# EAGLE design RAK4600_iBug (EAGLE 9.5.0)
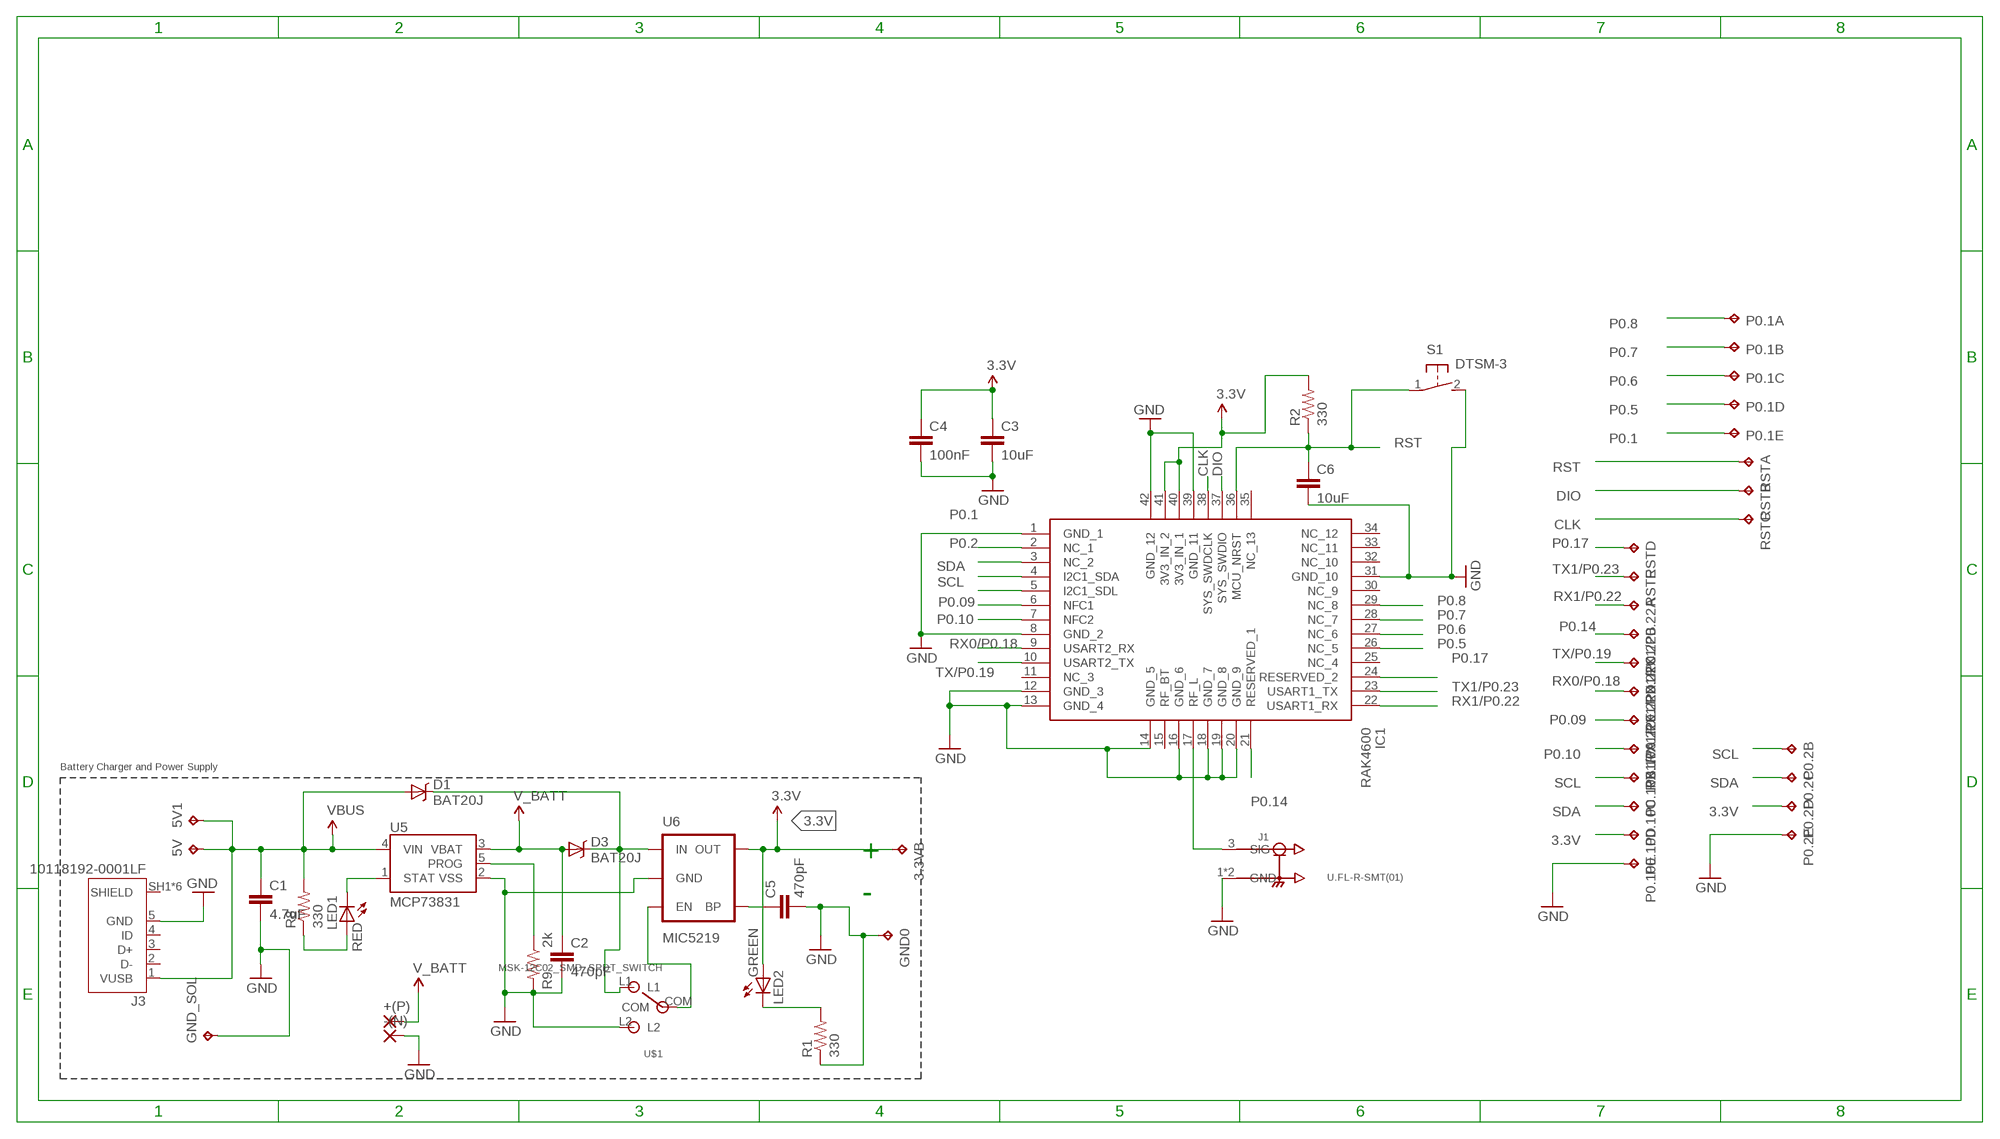
[diagram p0: schematic, sheet 1]

## Parts
3.3VB  TPTP12SQ  [TP12SQ]
5V  TPTP12SQ  [TP12SQ]
5V1  TPTP12SQ  [TP12SQ]
+(P)  SMD2  [SMD1,27-2,54]
-(N)  SMD2  [SMD1,27-2,54]
C1  4.7uF  CAP0402-CAP  [0402-CAP]
C2  470pF  CAP0402-CAP  [0402-CAP]
C3  10uF  CAP0402-CAP  [0402-CAP]
C4  100nF  CAP0402-CAP  [0402-CAP]
C5  470pF  CAP0402-CAP  [0402-CAP]
C6  10uF  CAP0402-CAP  [0402-CAP]
D1  BAT20J  DIODE-SCHOTTKY-BAT20J  [SOD-323]
D3  BAT20J  DIODE-SCHOTTKY-BAT20J  [SOD-323]
GND0  TPTP12SQ  [TP12SQ]
GND_SOL  TPTP12SQ  [TP12SQ]
IC1  RAK4600  [RAK4600]
J1  U.FL-R-SMT(01)  [HRS_U.FL-R-SMT(01)]
J3  10118192-0001LF  [AMPHENOL_10118192-0001LF]
LED1  RED  LED0603  [LED-0603]
LED2  GREEN  LED0603  [LED-0603]
P0.1  TP5P5-25-13  [P5-25-13]
P0.2  TP5P5-25-13  [P5-25-13]
P0.10  TP5P5-25-13  [P5-25-13]
R1  330  RESISTOR0402-RES  [0402-RES]
R2  330  RESISTOR0402-RES  [0402-RES]
R8  330  RESISTOR0402-RES  [0402-RES]
R9  2k  RESISTOR0603-RES  [0603-RES]
RST  TP5P5-25-13  [P5-25-13]
RX1/P0.22  TP5P5-25-13  [P5-25-13]
S1  DTSM-3  [DTSM-3]
U5  MCP73831  [SOT23-5]
U6  MIC5219  V_REG_MIC52193.3V  [SOT23-5]
U$1  MSK-12C02_SMD_SPDT_SWITCH  [MSK-12C02]

## Nets
3.3V: 3.3VB.TP C3.1 C4.1 IC1.40(3V3_IN_1) IC1.41(3V3_IN_2) LED2.A P0.2.TP-4 P0.10.TP-4 R2.2 U6.5(OUT)
5V: 5V1.TP 5V.TP C1.1 D1.A J3.1(VUSB) R8.2 U5.4(VIN) ; supply symbol labelled VBUS
CLK: IC1.38(SYS_SWDCLK) RST.TP-3
DIO: IC1.37(SYS_SWDIO) RST.TP-2
GND: -(N).1(P) C1.2 C2.2 C3.2 C4.2 C5.2 C6.2 GND0.TP GND_SOL.TP IC1.1(GND_1) IC1.8(GND_2) IC1.12(GND_3) IC1.13(GND_4) IC1.14(GND_5) IC1.16(GND_6) IC1.18(GND_7) IC1.19(GND_8) IC1.20(GND_9) IC1.31(GND_10) IC1.39(GND_11) IC1.42(GND_12) J1.1(GND) J1.2(GND) J3.5(GND) P0.2.TP-5 P0.10.TP-5 R1.1 R9.2 S1.2 U5.2(VSS) U6.2(GND) U$1.L2
N$1: LED2.C R1.2
N$2: D1.C D3.C U6.1(IN) U$1.L1
N$3: IC1.17(RF_L) J1.3(SIG)
N$4: R9.1 U5.5(PROG)
N$5: U6.3(EN) U$1.COM
N$12: LED1.A R8.1
N$13: LED1.C U5.1(STAT)
N$15: C5.1 U6.4(BP)
P0.1: IC1.2(NC_1) P0.1.TP-5
P0.2: IC1.3(NC_2)
P0.5: IC1.26(NC_5) P0.1.TP-4
P0.6: IC1.27(NC_6) P0.1.TP-3
P0.7: IC1.28(NC_7) P0.1.TP-2
P0.8: IC1.29(NC_8) P0.1.TP-1
P0.09: IC1.6(NFC1) RX1/P0.22.TP-5
P0.10: IC1.7(NFC2) P0.10.TP-1
P0.14: IC1.21(RESERVED_1) RX1/P0.22.TP-2
P0.17: IC1.24(RESERVED_2) RST.TP-4
RST: C6.1 IC1.36(MCU_NRST) R2.1 RST.TP-1 S1.1
RX0/P0.18: IC1.9(USART2_RX) RX1/P0.22.TP-4
RX1/P0.22: IC1.22(USART1_RX) RX1/P0.22.TP-1
SCL: IC1.5(I2C1_SDL) P0.2.TP-2 P0.10.TP-2
SDA: IC1.4(I2C1_SDA) P0.2.TP-3 P0.10.TP-3
TX1/P0.23: IC1.23(USART1_TX) RST.TP-5
TX/P0.19: IC1.10(USART2_TX) RX1/P0.22.TP-3
V_BATT: +(P).1(P) C2.1 D3.A U5.3(VBAT)
Unconnected: IC1.11(NC_3) IC1.15(RF_BT) IC1.25(NC_4) IC1.30(NC_9) IC1.32(NC_10) IC1.33(NC_11) IC1.34(NC_12) IC1.35(NC_13) J3.2(D-) J3.3(D+) J3.4(ID) J3.SH1(SHIELD) J3.SH2(SHIELD) J3.SH3(SHIELD) J3.SH4(SHIELD) J3.SH5(SHIELD) J3.SH6(SHIELD) P0.2.TP-1

## Notes on the sheet
- Battery Charger and Power Supply
- +
- -

## Library data of the parts
3.3VB 5V 5V1 GND0 GND_SOL = testpad:TP: Test pad; SPICEPREFIX: X
+(P) -(N) = wirepad:SMD2: SMD PAD
C1-C6 = SparkFun-Passives:CAP: Capacitor Standard 0603 ceramic capacitor, and 0.1" leaded capacitor.; PROD_ID: CAP-07884
D1 D3 = SparkFun-DiscreteSemi:DIODE-SCHOTTKY: Schottky diodes in SFE's production catalog BAT20J 1A 23V 0.62Vf RB751 120mA 40V 0.37Vf PMEG4005EJ 0.5A 40V 0.42Vf MBRA140 1A 40V 0.5Vf B340A 3A 40V SMA; PROD_ID: DIO-11623
IC1 = SamacSys_Parts:RAK4600: LoRa Module Source: Datasheet <https://doc.rakwireless.com/datasheet/rakproducts/rak4600-lora-module-datasheet>; ARROW_PART_NUMBER: RAK4600; DESCRIPTION: LoRa Module; HEIGHT: 2.5mm; MANUFACTURER_NAME: RAK; MANUFACTURER_PART_NUMBER: RAK4600
J1 = U.FL-R-SMT_01_:U.FL-R-SMT(01): U.FL Series 6 Ghz 50 Ohm Ultra-small SMT Coaxial Cable Receptacle Check prices <https://pricing.snapeda.com/search/part/U.FL-R-SMT%2801%29/?ref=eda>; AVAILABILITY: Warning; DESCRIPTION: U.FL (UMCC) Connector Receptacle, Male Pin 50Ohm Surface Mount Solder; MF: Hirose; MP: U.FL-R-SMT(01); PACKAGE: None; PRICE: None; PURCHASE-URL: https://pricing.snapeda.com/search/part/U.FL-R-SMT(01)/?ref=eda
J3 = 10118192-0001LF:10118192-0001LF: Single Port 5 Contact Horizontal Right Angle Shielded Micro B USB 2.0 Connector; AVAILABILITY: Unavailable; DESCRIPTION: USB - micro B USB 2.0 Receptacle Connector 5 Position Surface Mount, Right Angle; MF: Amphenol ICC; MP: 10118192-0001LF; PACKAGE: None; PRICE: None
LED1 LED2 = SparkFun-LED:LED: LEDs Standard schematic elements and footprints for 5mm, 3mm, 1206, and 0603 sized LEDs. 5mm - Spark Fun Electronics SKU : COM-00529 (and others); PROD_ID: DIO-00819
P0.1 P0.2 P0.10 RST RX1/P0.22 = testpad:TP5: Test pad
R1 R2 R8 = SparkFun-Passives:RESISTOR: Resistor Basic schematic elements and footprints for 0603, 1206, and PTH resistors.; PROD_ID: RES-00818
R9 = SparkFun-Resistors:RESISTOR: Resistor Basic schematic elements and footprints for 0603, 1206, and PTH resistors.; PROD_ID: RES-00824
S1 = switch-tact:DTSM-3
U5 = SparkFun-PowerIC:MCP73831: Miniature single cell, fully integrated Li-Ion, Li-polymer charge management controller http://ww1.microchip.com/downloads/en/DeviceDoc/21984a.pdf IC-09995; PROD_ID: IC-09995
U6 = SparkFun-PowerIC:V_REG_MIC5219: V_REG MIC5219 Standard 3.3V and 5V 500mA LDO voltage regulator in SOT-23 layout. Micrel part MIC5219. BP (by-pass) pin is used to lower output noise with 470pF cap, may be left open.; PROD_ID: VREG-09872; VALUE: MIC5219 3.3V
U$1 = MSK-12C02 SMD Micro Slider Switch SPDT:MSK-12C02_SMD_SPDT_SWITCH: Footprint of the VIMEX MSK-12C02 SPDT SMD Switch Created by mzst on 17-Jan-2016

## Board
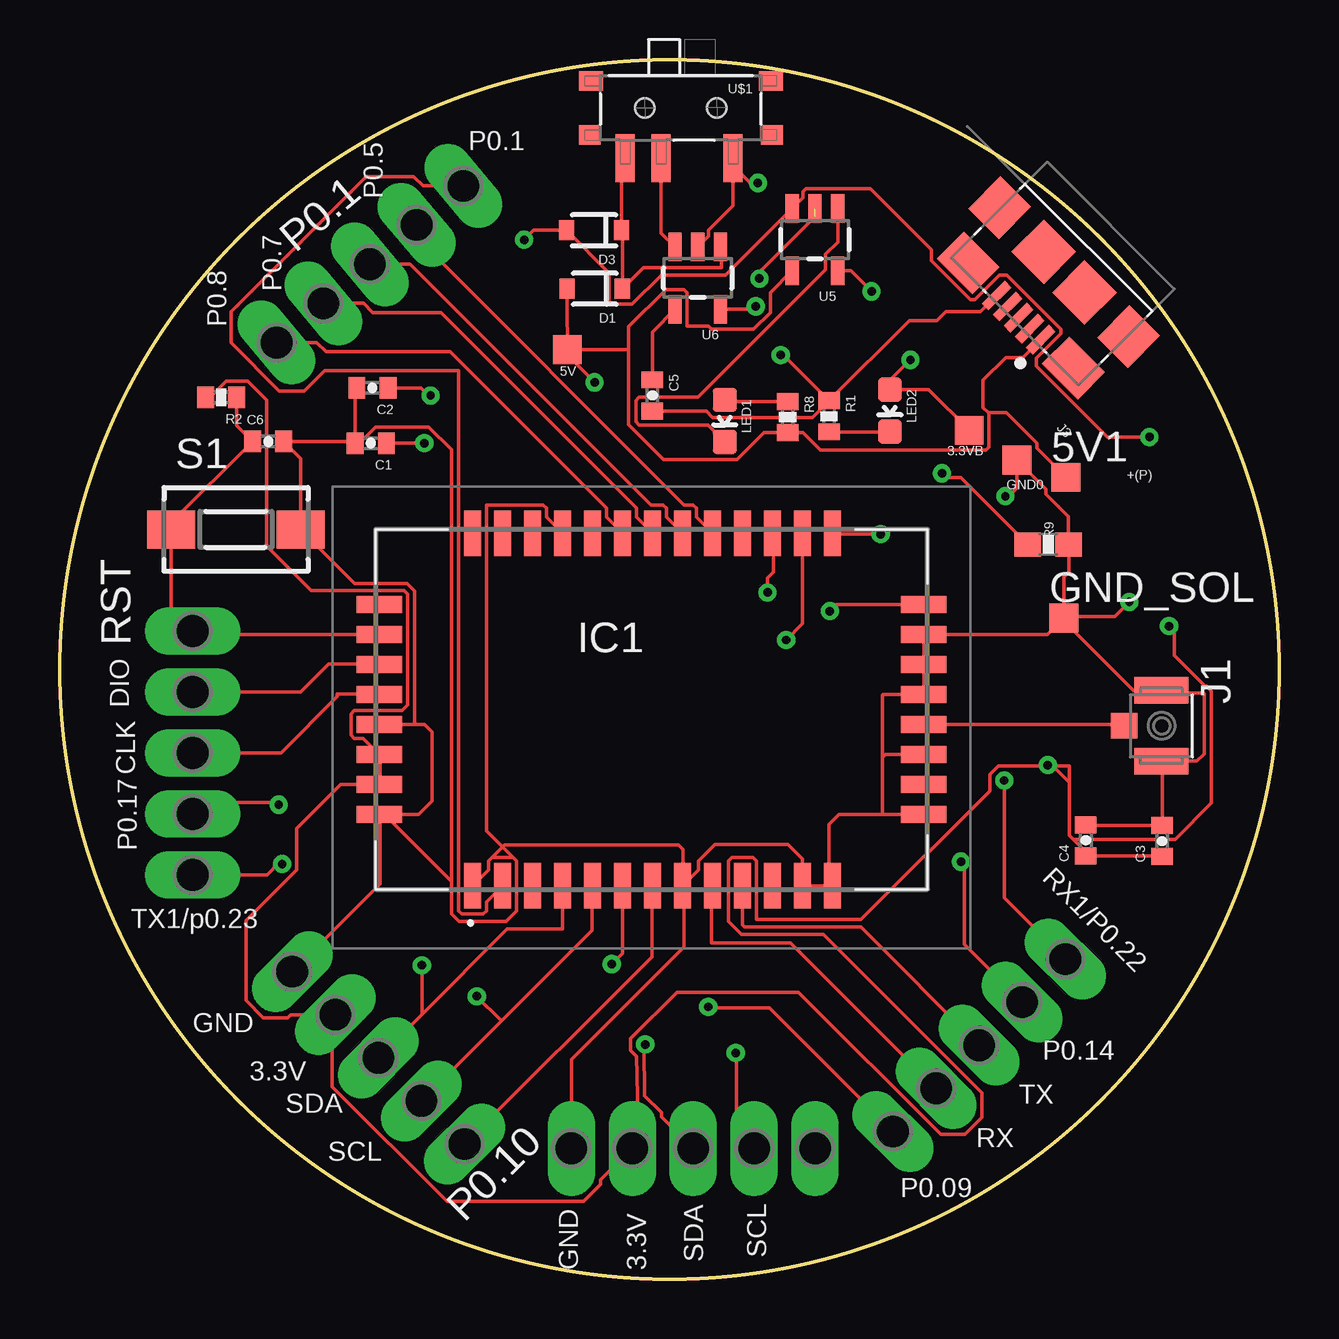
[diagram p1: board, top side]
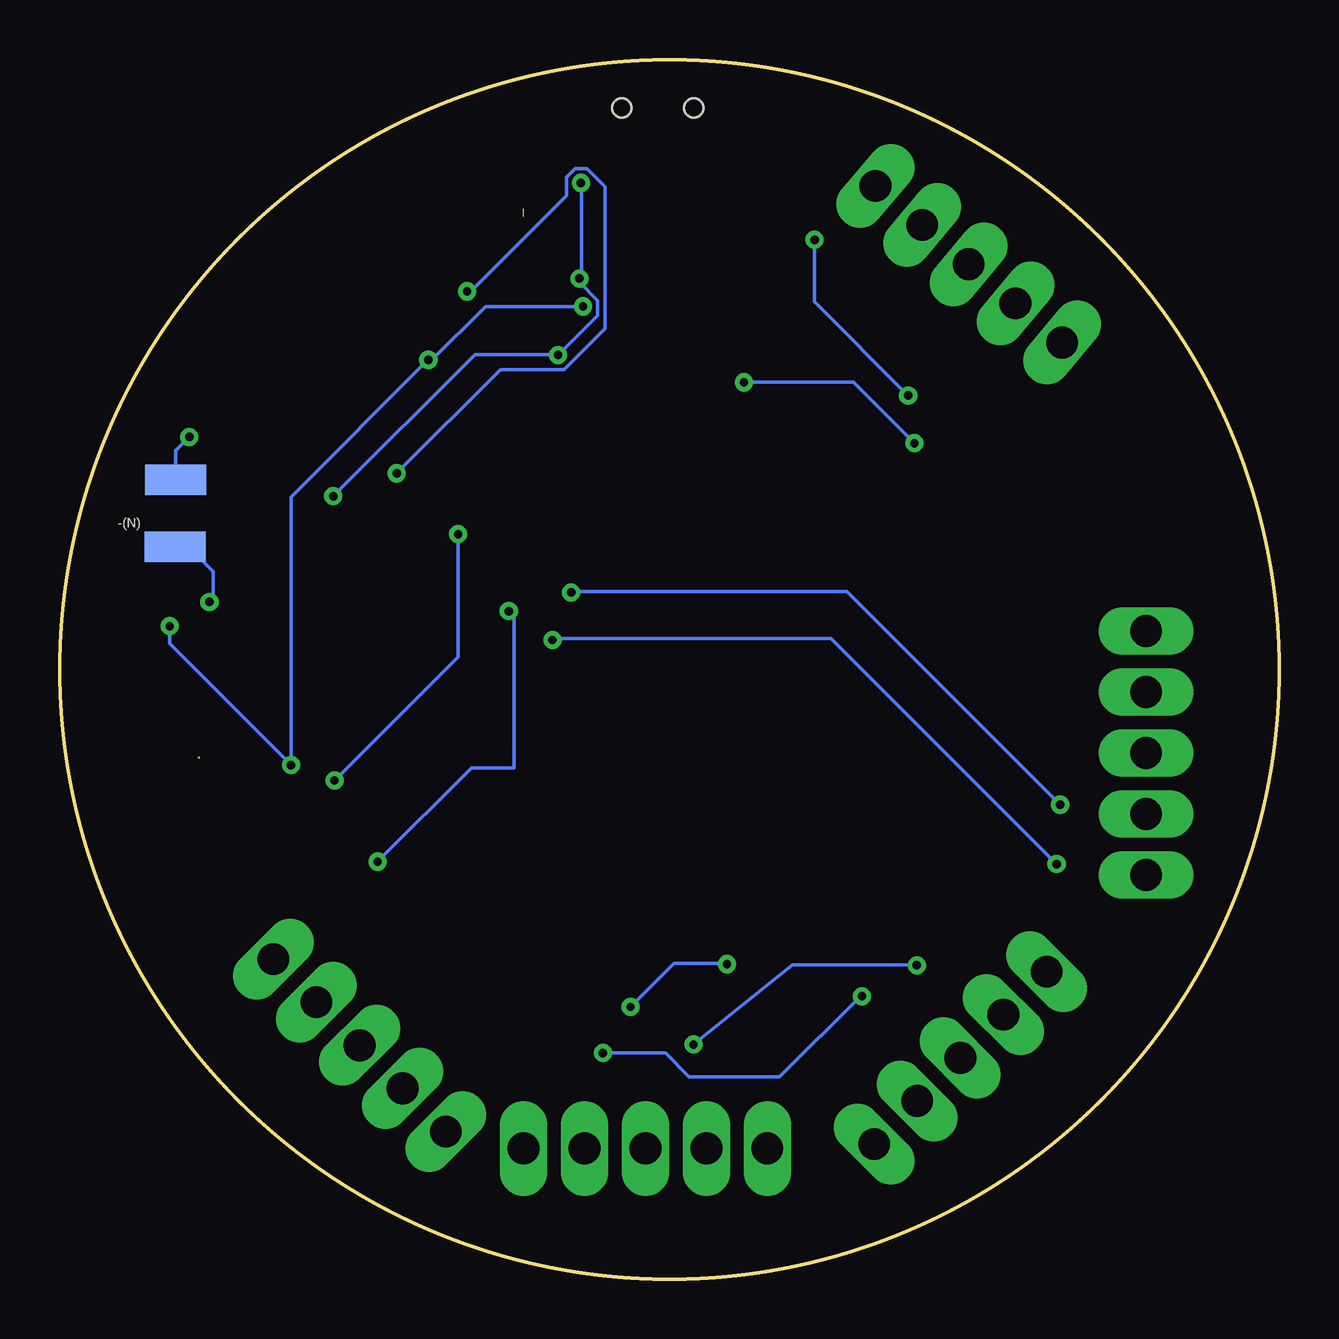
[diagram p2: board, bottom side, seen from below]

Size 50.8 x 50.8 mm. Coordinates in mm from the lower left corner, seen from the top.
Outline: circle at 25.4,25.4 radius 25.4
Copper layers (1*16): Top 0.035mm / dielectric 1.5mm / Bottom 0.035mm
Design rules "default": minimum track width 6mil, minimum drill 0.35mm, track to track 6mil, track to pad 6mil, pad to pad 6mil, via to via 6mil, smd to smd 6mil, copper to edge 40mil, drill to drill 6mil, minimum pad ring 10mil, minimum via ring 8mil, stop-mask expansion 4mil, vias tented up to drill 0mil, thermal gap 10mil

### Footprints (pad centres in the part's own frame; a part is rotated, then mirrored left to right if it is on the bottom)
TP12SQ = smd 1.2 x 1.2: TP 0,0
SMD1,27-2,54 = smd 1.27 x 2.54: 1 0,0
0402-CAP = smd 0.7 x 0.9: 1 -0.65,0; 2 0.65,0
SOD-323 = smd 0.63 x 0.83: A 1.15,0; C -1.15,0
RAK4600 = smd 0.7 x 1.9: 1 -7.5,-7.35; 2 -6.25,-7.35; 3 -5,-7.35; 4 -3.75,-7.35; 5 -2.5,-7.35; 6 -1.25,-7.35; 7 0,-7.35; 8 1.25,-7.35; 9 2.5,-7.35; 10 3.75,-7.35; 11 5,-7.35; 12 6.25,-7.35; 13 7.5,-7.35; 22 7.5,7.35; 23 6.25,7.35; 24 5,7.35; 25 3.75,7.35; 26 2.5,7.35; 27 1.25,7.35; 28 0,7.35; 29 -1.25,7.35; 30 -2.5,7.35; 31 -3.75,7.35; 32 -5,7.35; 33 -6.25,7.35; 34 -7.5,7.35 | smd 1.9 x 0.7: 14 11.309,-4.375; 15 11.309,-3.125; 16 11.309,-1.875; 17 11.309,-0.625; 18 11.309,0.625; 19 11.309,1.875; 20 11.309,3.125; 21 11.309,4.375; 35 -11.391,4.375; 36 -11.391,3.125; 37 -11.391,1.875; 38 -11.391,0.625; 39 -11.391,-0.625; 40 -11.391,-1.875; 41 -11.391,-3.125; 42 -11.391,-4.375
HRS_U.FL-R-SMT(01) = smd 1.1 x 2.25: 1 -1.475,0; 2 1.475,0 | smd 1.05 x 1.1: 3 0,-1.55
AMPHENOL_10118192-0001LF = smd 0.4 x 1.35: 1 -1.3,0; 2 -0.65,0; 3 0,0; 4 0.65,0; 5 1.3,0 | smd 2.1 x 1.6: SH1 -3.1,-0.125; SH2 3.1,-0.125 | smd 1.8 x 1.9: SH3 -3.8,-2.675; SH6 3.8,-2.675 | smd 1.9 x 1.9: SH4 -1.2,-2.675; SH5 1.2,-2.675
LED-0603 = smd 1 x 1: A 0,-0.877; C 0,0.877
P5-25-13 = drill 1.321 pad 1.905 long: TP-1 -5.08,0; TP-2 -2.54,0; TP-3 0,0; TP-4 2.54,0; TP-5 5.08,0
0402-RES = smd 0.7 x 0.9: 1 -0.65,0; 2 0.65,0
0603-RES = smd 1.1 x 1: 1 -0.85,0; 2 0.85,0
DTSM-3 = smd 2 x 1.6: 1 -2.7,0; 2 2.7,0
SOT23-5 = smd 0.55 x 1.2: 1 -0.95,-1.3; 2 0,-1.3; 3 0.95,-1.3; 4 0.95,1.3; 5 -0.95,1.3
MSK-12C02 = smd 0.8 x 2: COM 0.823,2.1; L1 2.323,2.1; L2 -2.177,2.1 | smd 1 x 0.8: GND@1 -3.75,-1.125; GND@4 3.75,-1.125 | smd 0.9 x 0.8: GND@2 -3.8,1.125; GND@3 3.8,1.125 | hole 0.8: -1.5,0; 1.5,0

### Placement (x,y rotation side)
3.3VB  37.9,35.37 180 top
5V  21.15,38.72 0 top
5V1  41.92,33.4 0 top
+(P)  45.98,33.31 270 bottom
-(N)  46,30.51 270 bottom
C1  12.96,34.82 180 top
C2  13.03,37.13 180 top
C3  45.94,18.25 90 top
C4  42.76,18.27 90 top
C5  24.69,36.81 270 top
C6  8.68,34.9 0 top
D1  22.29,41.26 180 top
D3  22.26,43.7 180 top
GND0  39.89,34.13 0 top
GND_SOL  41.84,27.54 0 top
IC1  24.7,23.73 0 top
J1  45.91,23.05 270 top
J3  39.96,40.06 135 top
LED1  27.71,35.75 180 top
LED2  34.6,36.19 180 top
P0.1  12.92,42.29 40 top
P0.2  26.39,5.43 180 top
P0.10  13.27,9.21 135 top
R1  32.06,35.95 270 top
R2  6.72,36.74 180 top
R8  30.33,35.92 270 top
R9  41.19,30.61 0 top
RST  5.53,21.91 270 top
RX1/P0.22  38.31,9.73 225 top
S1  7.34,31.23 0 top
U5  31.47,43.31 180 top
U6  26.59,41.71 180 top
U$1  25.88,48.8 180 top

### Tracks (layer width: path | path; a pad name or v marks a point on that pad's centre or on a via)
3.3V  (via drill 0.35)
  Top 0.152: P0.10.TP-4 11.3,11 | 11.3,11 9.61,11 9.49,10.88 8.48,10.88 7.76,11.59 7.76,14.93 9.87,17.04 9.87,18.77 11.7,20.6 IC1.41 | C3.1 45.91,17.62 C4.1 42.76,17.8 42.24,18.32 | U6.5 28.79,40.41 28.83,40.36 v29,40.53 | v35.45,38.3 34.6,37.45 LED2.A 36.2,37.06 3.3VB.TP | 11.3,11 11.35,10.95 11.35,8 16.13,3.22 21.82,3.22 22.53,3.94 22.53,4.11 P0.2.TP-4 24.07,5.65 24.07,7.63 24.04,9.26 23.79,9.51 23.79,10.02 25.71,11.94 30.79,11.94 36.71,6.02 37.72,6.02 38.44,6.73 38.44,7.74 31.81,14.36 28.41,14.36 27.87,14.9 27.87,17.42 28,17.56 28.89,17.56 29.03,17.42 29.03,14.97 33.39,14.97 38.75,20.33 38.75,21.02 39.11,21.38 42.08,21.38 42.08,20.68 | 42.08,20.68 42.08,18.47 42.24,18.32 | v41.17,21.41 41.35,21.41 42.08,20.68 | IC1.40 12.64,22.52 12.26,22.52 12.13,22.66 12.13,23.55 12.26,23.68 14.26,23.68 14.49,23.91 14.49,28.55 14.35,28.68 10.46,28.68 8.61,30.54 8.61,36.62 7.81,37.42 6.92,37.42 6.25,36.74 R2.2 | 42.24,18.32 46.48,18.32 48,19.83 48,24.49 47.78,24.71 47.72,24.71 46.45,25.98 46.45,27.2 v46.23,27.2
  Top 0.254: IC1.41 IC1.40
  Bottom 0.152: v29,40.53 33.06,40.53 35.37,38.22 v35.45,38.3 41.17,32.58 v41.17,21.41 | v41.17,21.41 | v46.23,27.2 46.23,26.47 v41.17,21.41
5V  (via drill 0.35)
  Top 0.152: 23.71,38.73 23.71,39.68 25.27,41.24 26.01,41.24 26.14,41.1 26.14,39.71 27.03,39.71 27.17,39.58 28.91,39.58 29.6,40.28 29.6,41.1 U5.4 | 23.71,38.73 23.71,35.59 25.15,34.15 28.22,34.15 29.34,35.27 R8.2 30.97,35.27 31.69,34.54 38.59,34.54 38.73,34.67 38.73,36.06 38.69,36.1 | D1.A 21.14,40.52 21.15,38.81 | 21.15,38.81 5V.TP 22.93,38.73 23.71,38.73 | 38.69,36.1 38.47,36.32 38.47,37.45 39.42,38.39 40.13,38.39 J3.1 | 5V1.TP 40.72,34.61 40.72,34.82 39.44,36.1 38.69,36.1 | C1.1 15.11,34.82 15.14,34.79 v15.19,34.83 | v22.29,37.37 21.15,38.51 21.15,38.81
  Bottom 0.152: v15.19,34.83 17.74,37.38 22.29,37.38 v22.29,37.37
CLK
  Top 0.152: RST.TP-3 9.21,21.91 11.56,24.26 11.56,24.37 13.29,24.37 IC1.38
DIO
  Top 0.152: RST.TP-2 10.02,24.45 11.2,25.63 13.28,25.63 IC1.37
GND  (via drill 0.35)  (1 unrouted)
  Top 0.152: 26.02,16.45 25.96,16.39 | 13.53,19.35 14.94,19.35 15.51,19.92 15.51,22.79 15.19,23.1 14.87,23.1 | 13.53,19.35 IC1.42 13.35,19.31 13.35,16.47 P0.10.TP-5 | 18,17.56 18.53,18.08 25.78,18.08 25.96,17.9 25.96,16.39 | IC1.8 25.96,16.39 | 26.02,16.45 26.62,17.05 26.62,17.42 27.3,18.1 30.35,18.1 30.95,17.5 IC1.12 IC1.13 32.06,16.52 32.06,18.94 32.47,19.35 34.29,19.35 | IC1.14 34.29,19.35 | 34.29,19.35 34.29,21.74 | 34.29,21.74 34.4,21.85 IC1.16 | 34.29,21.74 34.29,24.33 34.31,24.35 IC1.18 IC1.19 IC1.20 41.15,26.85 41.78,27.48 | C4.2 42.78,18.9 C3.2 45.94,21.54 J1.2 47.39,21.57 47.69,21.88 47.69,24.37 47.65,24.41 46.08,24.41 46.05,24.38 J1.1 44.75,24.52 41.78,27.48 | R1.1 35.41,39.94 36.55,39.94 36.92,40.31 38.37,40.31 J3.5 | C5.2 26.95,36.16 27.21,35.9 31.37,35.9 R1.1 | U6.2 27.03,43.46 27.03,43.7 28.05,44.73 28.05,46.41 | GND_SOL.TP 41.91,27.61 43.97,27.61 v44.57,28.21 | 41.78,27.48 GND_SOL.TP | 28.05,46.41 U$1.L2 | v29.15,41.69 29.15,41.96 31.47,44.28 | v29.09,45.67 28.79,45.67 28.05,46.41 | R1.1 30.27,38.38 30.16,38.38 v30.04,38.5 | P0.2.TP-5 21.31,9.14 26.02,13.84 26.02,16.45 | 18,17.56 17.87,17.42 17.87,17.05 IC1.1 | 18,17.56 18.89,17.56 | 16.32,16.57 16.32,15.21 16.63,14.89 18.59,14.89 19.03,15.33 19.03,17.42 18.89,17.56 | 16.32,16.57 13.53,19.35 | v39.41,32.62 39.55,32.62 39.89,32.95 GND0.TP 41.1,32.92 41.1,32.71 42.04,31.77 R9.2 42.05,30.6 42.05,29.47 41.84,29.26 GND_SOL.TP | 12.23,34.9 C6.2 10.04,34.19 S1.2 12.28,28.99 14.48,28.99 14.79,28.67 14.79,23.18 14.87,23.1 | 12.23,34.9 C1.2 12.31,37.06 C2.2 | 12.23,34.9 12.56,34.9 13.16,35.5 15.37,35.5 16.32,34.56 16.32,16.57
  Top 0.152: 18.89,17.56 17.78,18.67 17.78,32.26 20.14,32.26 20.28,32.12 20.28,31.75 IC1.31 | 14.87,23.1 IC1.39
  Bottom 0.152: v29.09,45.67 29.07,45.67 29.07,41.77 v29.15,41.69 29.15,41.54 28.39,40.78 28.39,40.15 30.02,38.52 | v30.04,38.5 30.02,38.52 | v44.57,28.21 44.43,28.36 44.43,29.48 45.45,30.51 -(N).1 | v39.41,32.62 33.51,38.52 30.02,38.52
N$1
  Top 0.152: 34.58,35.3 R1.2
  Top 0.305: 34.58,35.3 LED2.C
N$2
  Top 0.152: D3.C 23.41,43.83 | 23.41,43.83 23.41,46.56 U$1.L1 | 23.41,43.83 23.44,43.81 D1.C 24.32,42.14 27.58,42.14 27.58,42.97 U6.1
N$3
  Top 0.152: IC1.17 44.3,23.1 J1.3
N$4  (via drill 0.35)
  Top 0.152: R9.1 37.55,33.4 36.77,33.4 v36.77,33.57 | v33.83,41.16 32.98,42.01 U5.5
  Bottom 0.152: v36.77,33.57 32.44,37.89 29.79,37.89 28.09,39.6 28.09,45.53 28.84,46.28 29.34,46.28 29.7,45.92 29.7,45.15 33.76,41.08 v33.83,41.16
N$5
  Top 0.152: U6.3 25.05,43.59 U$1.COM
N$12
  Top 0.152: R8.1 27.78,36.57 LED1.A
N$13
  Top 0.152: U5.1 32.42,43.21 31.91,42.7 31.91,42.07 26.59,36.74 24.14,36.74 24.01,36.61 24.01,35.72 24.14,35.59 27.01,35.59 LED1.C
N$15
  Top 0.152: C5.1 24.69,39.46 U6.4
P0.1
  Top 0.152: IC1.2 17.78,15.71 17.78,15.33 17.64,15.2 16.75,15.2 16.62,15.33 16.62,37.85 11.03,37.85 10.19,37.01 9.14,37.01 7.13,39.02 7.13,40.3 12.77,45.94 14.75,45.94 15.13,45.55 P0.1.TP-5
P0.5
  Top 0.152: P0.1.TP-4 14.87,43.41 26.02,32.26 26.39,32.26 26.53,32.12 26.53,31.75 IC1.26
P0.6
  Top 0.152: IC1.27 25.28,31.75 25.28,32.12 25.14,32.26 24.63,32.26 14.6,42.29 P0.1.TP-3
P0.7
  Top 0.152: IC1.28 24.03,31.75 24.03,32.12 15.88,40.27 13.03,40.27 12.65,40.66 P0.1.TP-2
P0.8
  Top 0.152: IC1.29 22.78,31.75 22.78,32.12 16.26,38.64 11.09,38.64 10.7,39.02 P0.1.TP-1
P0.09  (via drill 0.35)
  Top 0.152: RX1/P0.22.TP-5 29.57,11.29 27.06,11.29 v27.02,11.33 | v23,13.11 23.45,13.56 IC1.6
  Bottom 0.152: v27.02,11.33 25.2,13.15 23,13.15 v23,13.11
P0.10
  Top 0.152: P0.10.TP-1 24.67,13.42 24.67,16.35 IC1.7
P0.14  (via drill 0.35)
  Top 0.152: RX1/P0.22.TP-2 37.7,13.94 37.7,17.31 37.63,17.38 v37.56,17.38 | v32.09,27.83 32.37,28.1 IC1.21
  Bottom 0.152: v37.56,17.38 33.64,21.3 31.88,21.3 31.88,27.69 32.02,27.83 v32.09,27.83
P0.17  (via drill 0.35)
  Top 0.152: RST.TP-4 6,19.84 9.03,19.84 v9.12,19.76 | v29.49,28.61 29.49,29.2 29.75,29.46 29.75,31.03 IC1.24
  Bottom 0.152: v9.12,19.76 18.01,28.65 29.49,28.65 v29.49,28.61
RST
  Top 0.152: IC1.36 5.67,26.85 RST.TP-1 4.64,27.89 S1.1 4.64,31.51 C6.1 7.37,35.56 R2.1
RX0/P0.18
  Top 0.152: RX1/P0.22.TP-4 30.46,14 27.16,14 27.16,16.34 IC1.9
RX1/P0.22  (via drill 0.35)
  Top 0.152: RX1/P0.22.TP-1 39.36,15.87 v39.36,20.77 | v34.21,31.04 32.24,31.04 IC1.22
  Bottom 0.152: v39.36,20.77 34.21,25.92 v34.21,31.04
SCL  (via drill 0.35)
  Top 0.152: P0.10.TP-2 18.42,10.76 | 18.42,10.76 22.18,14.53 22.18,16.36 IC1.5 | P0.2.TP-2 28.21,6.16 28.21,9.41 v28.17,9.41 | v17.37,11.77 18.38,10.76 18.42,10.76
  Bottom 0.152: v28.17,9.41 25.57,9.41 24.58,8.42 20.8,8.42 17.44,11.77 v17.37,11.77
SDA  (via drill 0.35)
  Top 0.152: 15.09,11.02 18.64,14.57 20.94,14.57 20.94,16.84 20.95,16.83 IC1.4 | P0.2.TP-3 25.07,6.75 25.07,6.93 24.37,7.63 24.34,9.68 v24.4,9.76 | v15.09,13.06 15.09,11.02 | 15.09,11.02 P0.10.TP-3
  Bottom 0.152: v24.4,9.76 20.26,13.09 15.09,13.09 v15.09,13.06
TX1/P0.23  (via drill 0.35)
  Top 0.152: RST.TP-5 8.63,16.83 9.14,17.35 9.2,17.35 v9.26,17.29 | v30.27,26.62 30.95,27.3 IC1.23
  Bottom 0.152: v9.26,17.29 18.67,26.69 30.27,26.69 v30.27,26.62
TX/P0.19
  Top 0.152: RX1/P0.22.TP-3 33.38,14.67 28.53,14.67 28.45,14.75 IC1.10
V_BATT  (via drill 0.35)
  Top 0.152: C2.1 15.05,37.13 15.41,36.78 | 15.41,36.78 | 15.41,36.78 v15.45,36.82 | v19.35,43.31 19.74,43.7 D3.A 22.9,41.92 22.9,40.75 23.03,40.62 23.85,40.62 25.06,41.84 27.74,41.84 U5.3 30.96,45.06 30.96,45.3 31.1,45.44 33.78,45.44 36.32,42.9 36.32,42.43 37.94,40.81 38.13,40.81 39.15,41.83 39.47,41.83 41.73,39.58 41.73,39.39 40.7,38.36 40.7,38.04 43.66,35.09 v45.41,35.09
  Bottom 0.152: v45.41,35.09 45.98,34.51 +(P).1 | v15.45,36.82 19.35,40.72 v19.35,43.31

### Text on the board
tPlace: P0.1 | P0.5 | P0.7 | P0.8 | DIO | CLK | P0.17 | TX1/p0.23 | GND | 3.3V | P0.14 | SDA | TX | SCL | RX | P0.09 | GND | 3.3V | SDA | SCL